# Altium schematic sheet Fuente_Alimentacion.SchDoc
size A3; Organization: Altium Limited; Address1: L3, 12a Rodborough Rd; Address2: Frenchs Forest; Address3: NSW; Address4: Australia 2086
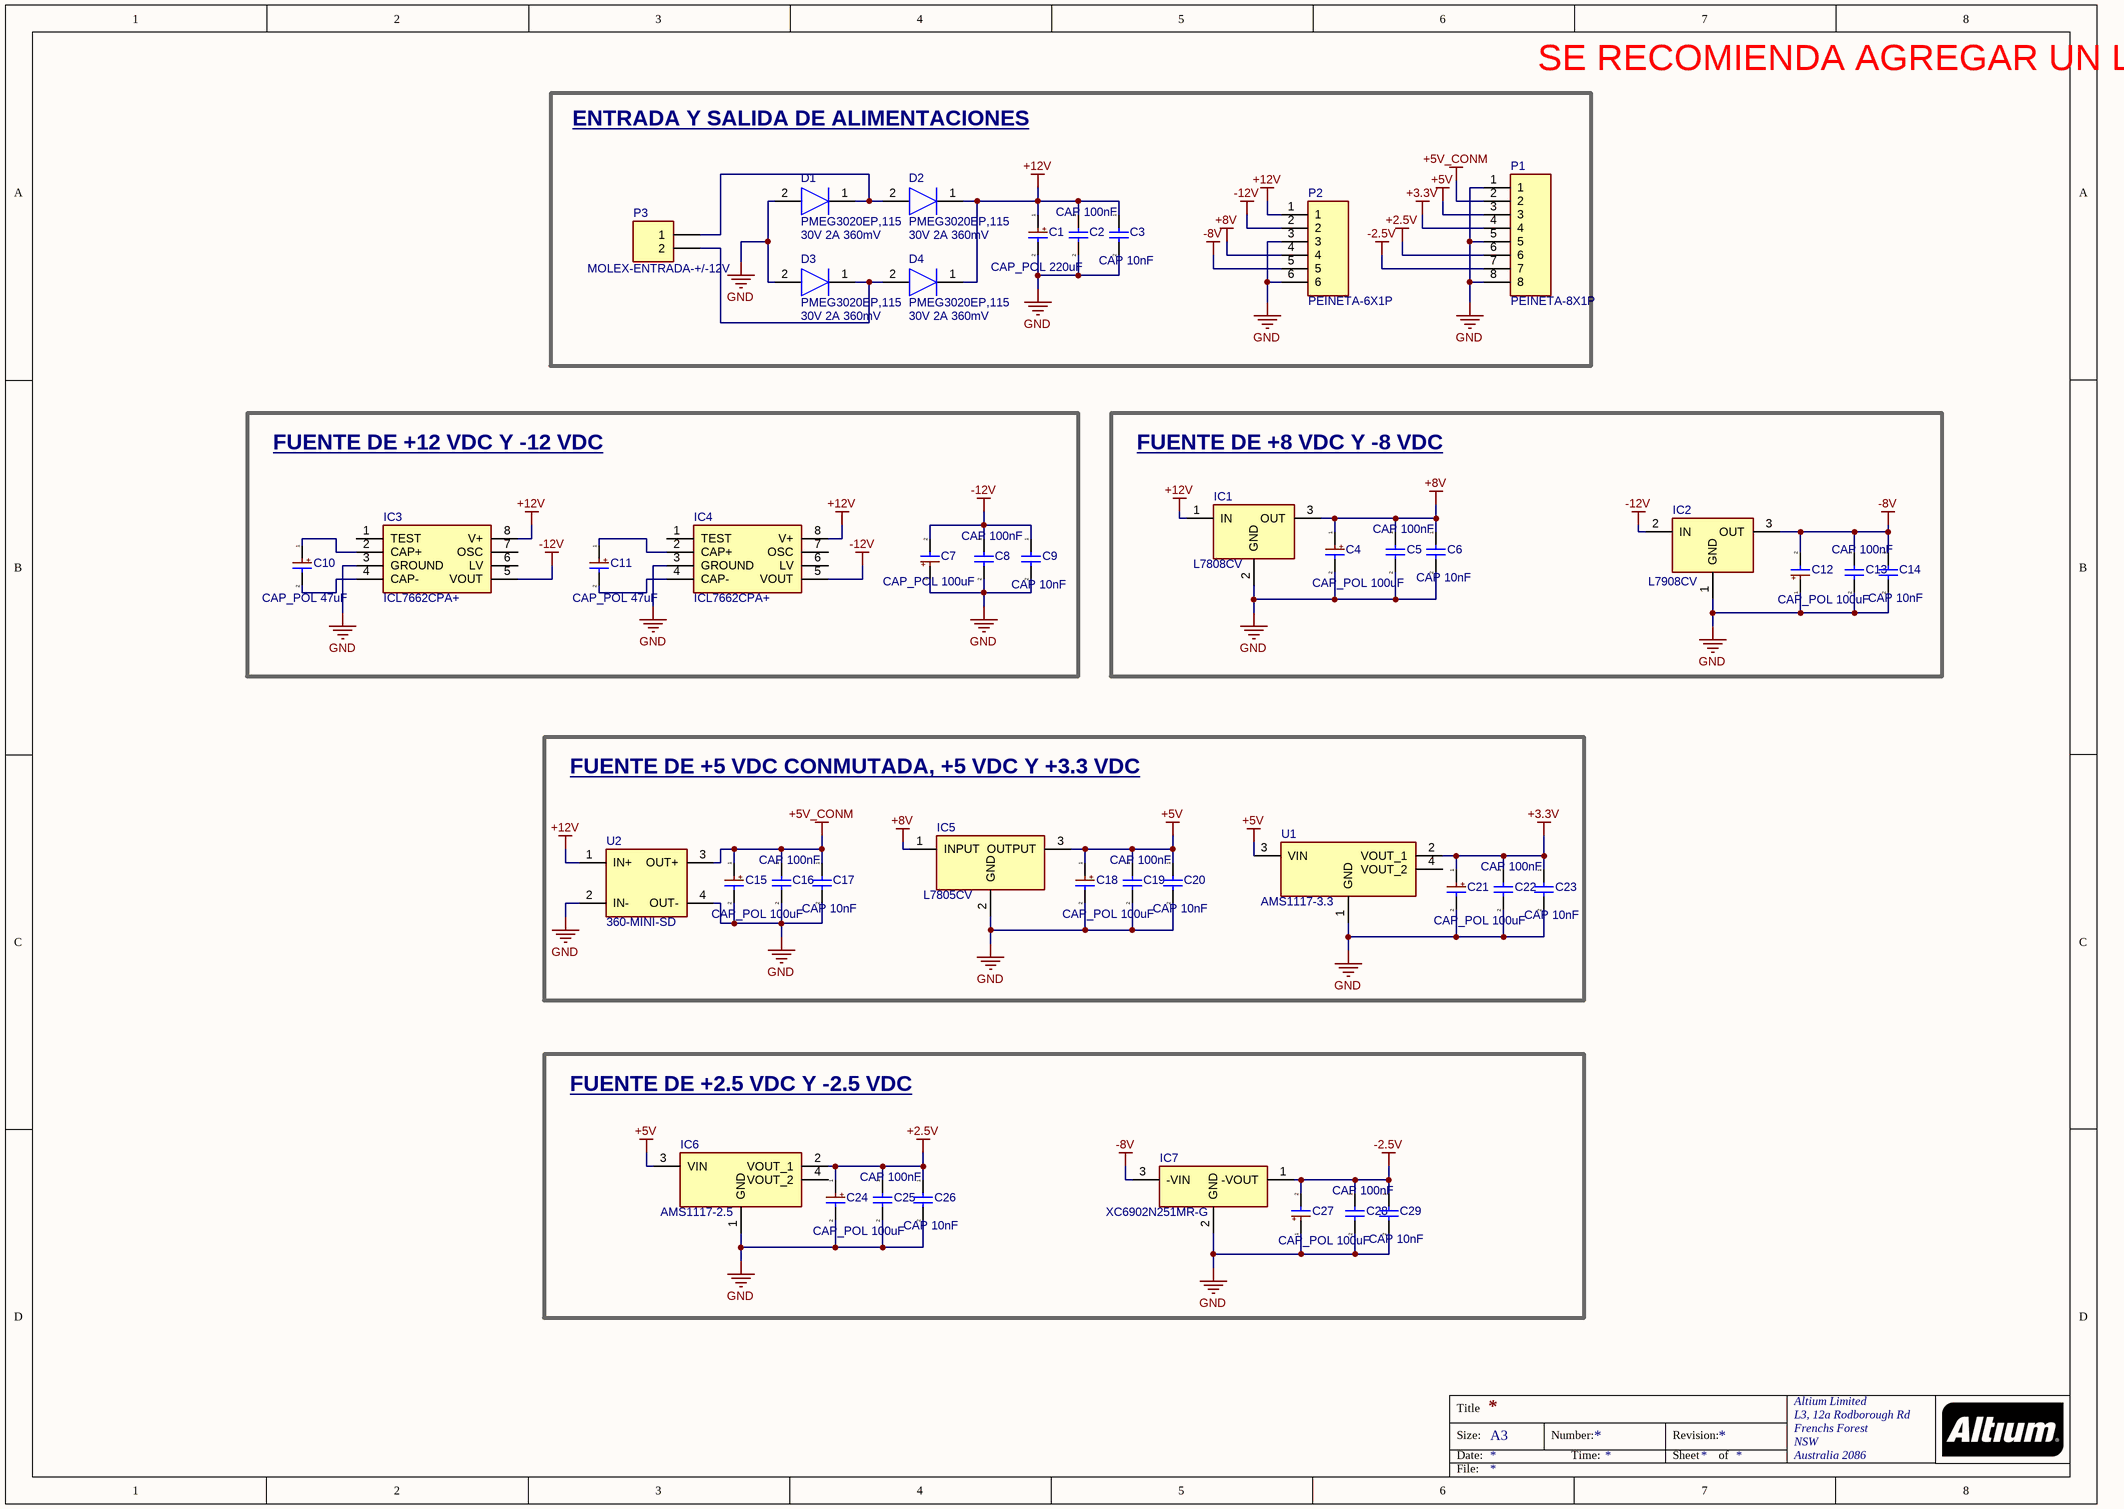
[diagram p0: Fuente_Alimentacion.SchDoc]

## Parts
C1  CAP_POL 220uF  [CAP-2.5-6.3MM]
C2  CAP 100nF  [RADIAL-0.1]
C3  CAP 10nF  [RADIAL-0.1]
C4  CAP_POL 100uF  [CAP-2.0-5.0MM]
C5  CAP 100nF  [RADIAL-0.1]
C6  CAP 10nF  [RADIAL-0.1]
C7  CAP_POL 100uF  [CAP-2.0-5.0MM]
C8  CAP 100nF  [RADIAL-0.1]
C9  CAP 10nF  [RADIAL-0.1]
C10  CAP_POL 47uF  [CAP-2.0-5.0MM]
C11  CAP_POL 47uF  [CAP-2.0-5.0MM]
C12  CAP_POL 100uF  [CAP-2.0-5.0MM]
C13  CAP 100nF  [RADIAL-0.1]
C14  CAP 10nF  [RADIAL-0.1]
C15  CAP_POL 100uF  [CAP-2.0-5.0MM]
C16  CAP 100nF  [RADIAL-0.1]
C17  CAP 10nF  [RADIAL-0.1]
C18  CAP_POL 100uF  [CAP-2.0-5.0MM]
C19  CAP 100nF  [RADIAL-0.1]
C20  CAP 10nF  [RADIAL-0.1]
C21  CAP_POL 100uF  [CAP-2.0-5.0MM]
C22  CAP 100nF  [RADIAL-0.1]
C23  CAP 10nF  [RADIAL-0.1]
C24  CAP_POL 100uF  [CAP-2.0-5.0MM]
C25  CAP 100nF  [RADIAL-0.1]
C26  CAP 10nF  [RADIAL-0.1]
C27  CAP_POL 100uF  [CAP-2.0-5.0MM]
C28  CAP 100nF  [RADIAL-0.1]
C29  CAP 10nF  [RADIAL-0.1]
D1  PMEG3020EP,115  value 30V 2A 360mV  [SODFL4725X110N]
D2  PMEG3020EP,115  value 30V 2A 360mV  [SODFL4725X110N]
D3  PMEG3020EP,115  value 30V 2A 360mV  [SODFL4725X110N]
D4  PMEG3020EP,115  value 30V 2A 360mV  [SODFL4725X110N]
IC1  L7808CV  [TO270P460X1020X2008-3P]
IC2  L7908CV  [TO270P460X1020X2008-3P]
IC3  ICL7662CPA+  [DIP794W56P254L938H457Q8N]
IC4  ICL7662CPA+  [DIP794W56P254L938H457Q8N]
IC5  L7805CV  [TO255P460X1020X2008-3P]
IC6  AMS1117-2.5  [SOT229P700X180-4N]
IC7  XC6902N251MR-G  [SOT95P280X130-3N]
P1  PEINETA-8X1P  [SIP-8X1P-M-V]
P2  PEINETA-6X1P  [SIP-6X1P-M-V]
P3  MOLEX-ENTRADA-+/-12V  [MOLEX-2P]
U1  AMS1117-3.3  [SOT229P700X180-4N]
U2  360-MINI-SD  [360-MINI-SD-v1]

## Blocks framed on the sheet
SE RECOMIENDA AGREGAR UN LED: C1-C3 D1-D4 P1-P3
FUENTE DE +12 VDC Y -12 VDC: C7-C11 IC3 IC4
FUENTE DE +8 VDC Y -8 VDC: C4-C6 C12-C14 IC1 IC2
FUENTE DE +5 VDC CONMUTADA, +5 VDC Y +3.3 VDC: C15-C23 IC5 U1 U2
FUENTE DE +2.5 VDC Y -2.5 VDC: C24-C29 IC6 IC7

## Nets
+2.5V: C24.1(-) C25.1 C26.1 IC6.2(VOUT_1) P1.6
+3.3V: C21.1(-) C22.1 C23.1 P1.4 U1.2(VOUT_1)
+5V: C18.1(-) C19.1 C20.1 IC5.3(OUTPUT) IC6.3(VIN) P1.3 U1.3(VIN)
+5V_CONM: C15.1(-) C16.1 C17.1 P1.2 U2.3(OUT+)
+8V: C4.1(-) C5.1 C6.1 IC1.3(OUT) IC5.1(INPUT) P2.4
+12V: C1.1(-) C2.1 C3.1 D2.1(K) D4.1(K) IC1.1(IN) IC3.8(V+) IC4.8(V+) P2.1 U2.1(IN+)
-2.5V: C27.2(+) C28.1 C29.1 IC7.1(-VOUT) P1.7
-8V: C12.2(+) C13.1 C14.1 IC2.3(OUT) IC7.3(-VIN) P2.5
-12V: C7.2(+) C8.1 C9.1 IC2.2(IN) IC3.5(VOUT) IC4.5(VOUT) P2.2
GND: C1.2(+) C2.2 C3.2 C4.2(+) C5.2 C6.2 C7.1(-) C8.2 C9.2 C12.1(-) C13.2 C14.2 C15.2(+) C16.2 C17.2 C18.2(+) C19.2 C20.2 C21.2(+) C22.2 C23.2 C24.2(+) C25.2 C26.2 C27.1(-) C28.2 C29.2 D1.2(A) D3.2(A) IC1.2(GND) IC2.1(GND) IC3.3(GROUND) IC4.3(GROUND) IC5.2(GND) IC6.1(GND) IC7.2(GND) P1.1 P1.5 P1.8 P2.3 P2.6 U1.1(GND) U2.2(IN-) U2.4(OUT-)
NetC10_1: C10.1(-) IC3.2(CAP+)
NetC10_2: C10.2(+) IC3.4(CAP-)
NetC11_1: C11.1(-) IC4.2(CAP+)
NetC11_2: C11.2(+) IC4.4(CAP-)
NetD1_1: D1.1(K) D2.2(A) P3.1
NetD3_1: D3.1(K) D4.2(A) P3.2

Not connected (* = marked no-connect by the designer): IC3 1(TEST) 6(LV) 7(OSC); IC4 1(TEST) 6(LV) 7(OSC); IC6 4(VOUT_2); U1 4(VOUT_2)

## Notes on the sheet
- ENTRADA Y SALIDA DE ALIMENTACIONES
- Title
- Size:
- Date:
- A3
- Number:
- Time:
- Revision:
- Sheet
- of
- File:

## Library data of the parts
C1 C4 C7 C10-C12 C15 C18 C21 C24 C27 = CAP_POL: Basicos
C2 C3 C5 C6 C8 C9 C13 C14 C16 C17 C19 C20 C22 C23 C25 C26 C28 C29 = CAP: Basicos
D1-D4 = PMEG3020EP,115: Diode; Manufacturer_Name: Nexperia; Info: 30V 2A 360mV @ 2A SOD-128 Schottky Barrier Diodes (SBD) ROHS; Datasheet Link: https://componentsearchengine.com/Datasheets/2/PMEG3020EP,115.pdf; Height: 1.1mm; Manufacturer_Part_Number: PMEG3020EP,115; Mouser Part Number: 771-PMEG3020EP115; Mouser Price/Stock: https://www.mouser.co.uk/ProductDetail/Nexperia/PMEG3020EP115?qs=GcY6OjH1zdnlY%252B06tUqEyw%3D%3D; Arrow Part Number: PMEG3020EP,115; Arrow Price/Stock: https://www.arrow.com/en/products/pmeg3020ep115/nexperia?region=nac; JLCPCB Part #: C513108; JLCPCB Basic: No; JLCPCB Price: 0.1911; Package: SOD-128
IC1 = L7808CV: Integrated Circuit; Manufacturer_Name: STMicroelectronics; Info: TO-220-3 Linear Voltage Regulators (LDO) ROHS; Datasheet Link: http://www.st.com/web/en/resource/technical/document/datasheet/CD00000444.pdf; Height: 4.6mm; Manufacturer_Part_Number: L7808CV; Mouser Part Number: 511-L7808CV; Mouser Price/Stock: https://www.mouser.co.uk/ProductDetail/STMicroelectronics/L7808CV?qs=ewe0KQ%2FSs5GFsjTXbJ%252ByYA%3D%3D; Arrow Part Number: L7808CV; Arrow Price/Stock: https://www.arrow.com/en/products/l7808cv/stmicroelectronics; JLCPCB Part #: C519076; JLCPCB Basic: No; JLCPCB Price: 0.2029; Package: TO-220-3
IC2 = L7908CV: Integrated Circuit; Manufacturer_Name: STMicroelectronics; Info: 1.1V @ 1A(typ) - - Fixed -35V -8V TO-220(TO-220-3) Linear Voltage Regulators (LDO) ROHS; Datasheet Link: http://www.st.com/web/en/resource/technical/document/datasheet/CD00000450.pdf; Height: 4.6mm; Manufacturer_Part_Number: L7908CV; Mouser Part Number: 511-L7908CV; Mouser Price/Stock: https://www.mouser.co.uk/ProductDetail/STMicroelectronics/L7908CV?qs=W%252B4obUA0F3a1iCcgpeCvfA%3D%3D; Arrow Part Number: L7908CV; Arrow Price/Stock: https://www.arrow.com/en/products/l7908cv/stmicroelectronics; JLCPCB Part #: C26162; JLCPCB Basic: No; JLCPCB Price: 0.4063; Package: TO-220,TO-220-3
IC3 IC4 = ICL7662CPA+: Integrated Circuit; Manufacturer_Name: Maxim Integrated; Info: 20V - DIP-8 DC-DC Converters ROHS; Datasheet Link: https://datasheet.datasheetarchive.com/originals/distributors/Datasheets-18/DSA-345107.pdf; Height: 4.572mm; Manufacturer_Part_Number: ICL7662CPA+; Mouser Part Number: 700-ICL7662CPA; Mouser Price/Stock: https://www.mouser.co.uk/ProductDetail/Maxim-Integrated/ICL7662CPA%2b?qs=0Y9aZN%252BMVCV5CIR47Klr4Q%3D%3D; JLCPCB Part #: C14340; JLCPCB Basic: No; JLCPCB Price: 2.6457; Package: DIP-8
IC5 = L7805CV: Integrated Circuit; Manufacturer_Name: STMicroelectronics; Info: 35V 2V @ 1A(typ) - - Fixed 5V TO-220(TO-220-3) Linear Voltage Regulators (LDO) ROHS; Datasheet Link: http://www.st.com/web/en/resource/technical/document/datasheet/CD00000444.pdf; Height: 4.6mm; Manufacturer_Part_Number: L7805CV; Mouser Part Number: 511-L7805CV; Mouser Price/Stock: https://www.mouser.co.uk/ProductDetail/STMicroelectronics/L7805CV?qs=9NrABl3fj%2FqplZAHiYUxWg%3D%3D; Arrow Part Number: L7805CV; Arrow Price/Stock: https://www.arrow.com/en/products/l7805cv/stmicroelectronics; JLCPCB Part #: C111887; JLCPCB Basic: No; JLCPCB Price: 0.2153; Package: TO-220,TO-220-3
IC6 = AMS1117-2.5: Integrated Circuit; Manufacturer_Name: Advanced Monolithic Systems; Info: 15V 1.3V @ 1A - - Fixed 2.5V SOT-223 Linear Voltage Regulators (LDO) ROHS; Datasheet Link: https://datasheet.lcsc.com/szlcsc/Advanced-Monolithic-Systems-AMS-AMS1117-2-5_C12087.pdf; Height: 1.8mm; Manufacturer_Part_Number: AMS1117-2.5; Package: SOT-223; JLCPCB Price: 0.1709; JLCPCB Basic: No; JLCPCB Part #: C12087
IC7 = XC6902N251MR-G: Integrated Circuit; Manufacturer_Name: Torex; Info: Fixed -2.5V Linear Voltage Regulators (LDO) ROHS; Datasheet Link: http://www.mouser.com/ds/2/760/XC6902-846637.pdf; Height: 1.3mm; Manufacturer_Part_Number: XC6902N251MR-G; Mouser Part Number: 865-XC6902N251MR-G; Mouser Price/Stock: https://www.mouser.co.uk/ProductDetail/Torex-Semiconductor/XC6902N251MR-G/?qs=AsjdqWjXhJ97TLkuQPXWBQ%3D%3D; Package: SOT-23
P1 = PEINETA-8X1P: Conector
P2 = PEINETA-6X1P: Conector
P3 = MOLEX-2P: Conector
U1 = AMS1117-3.3: Integrated Circuit; Manufacturer_Name: Advanced Monolithic Systems; Info: 15V 1.3V @ 800mA - - Fixed 3.3V SOT-223 Linear Voltage Regulators (LDO) ROHS; Datasheet Link: http://www.advanced-monolithic.com/pdf/ds1117.pdf; Height: 1.8mm; Manufacturer_Part_Number: AMS1117-3.3; JLCPCB Part #: C6186; JLCPCB Price: 0.1605; Package: SOT-223-3
U2 = 360-MINI-SD: Basicos